# EAGLE schematic Syn-ShieldCarger-v07-tmp (EAGLE 5.10)
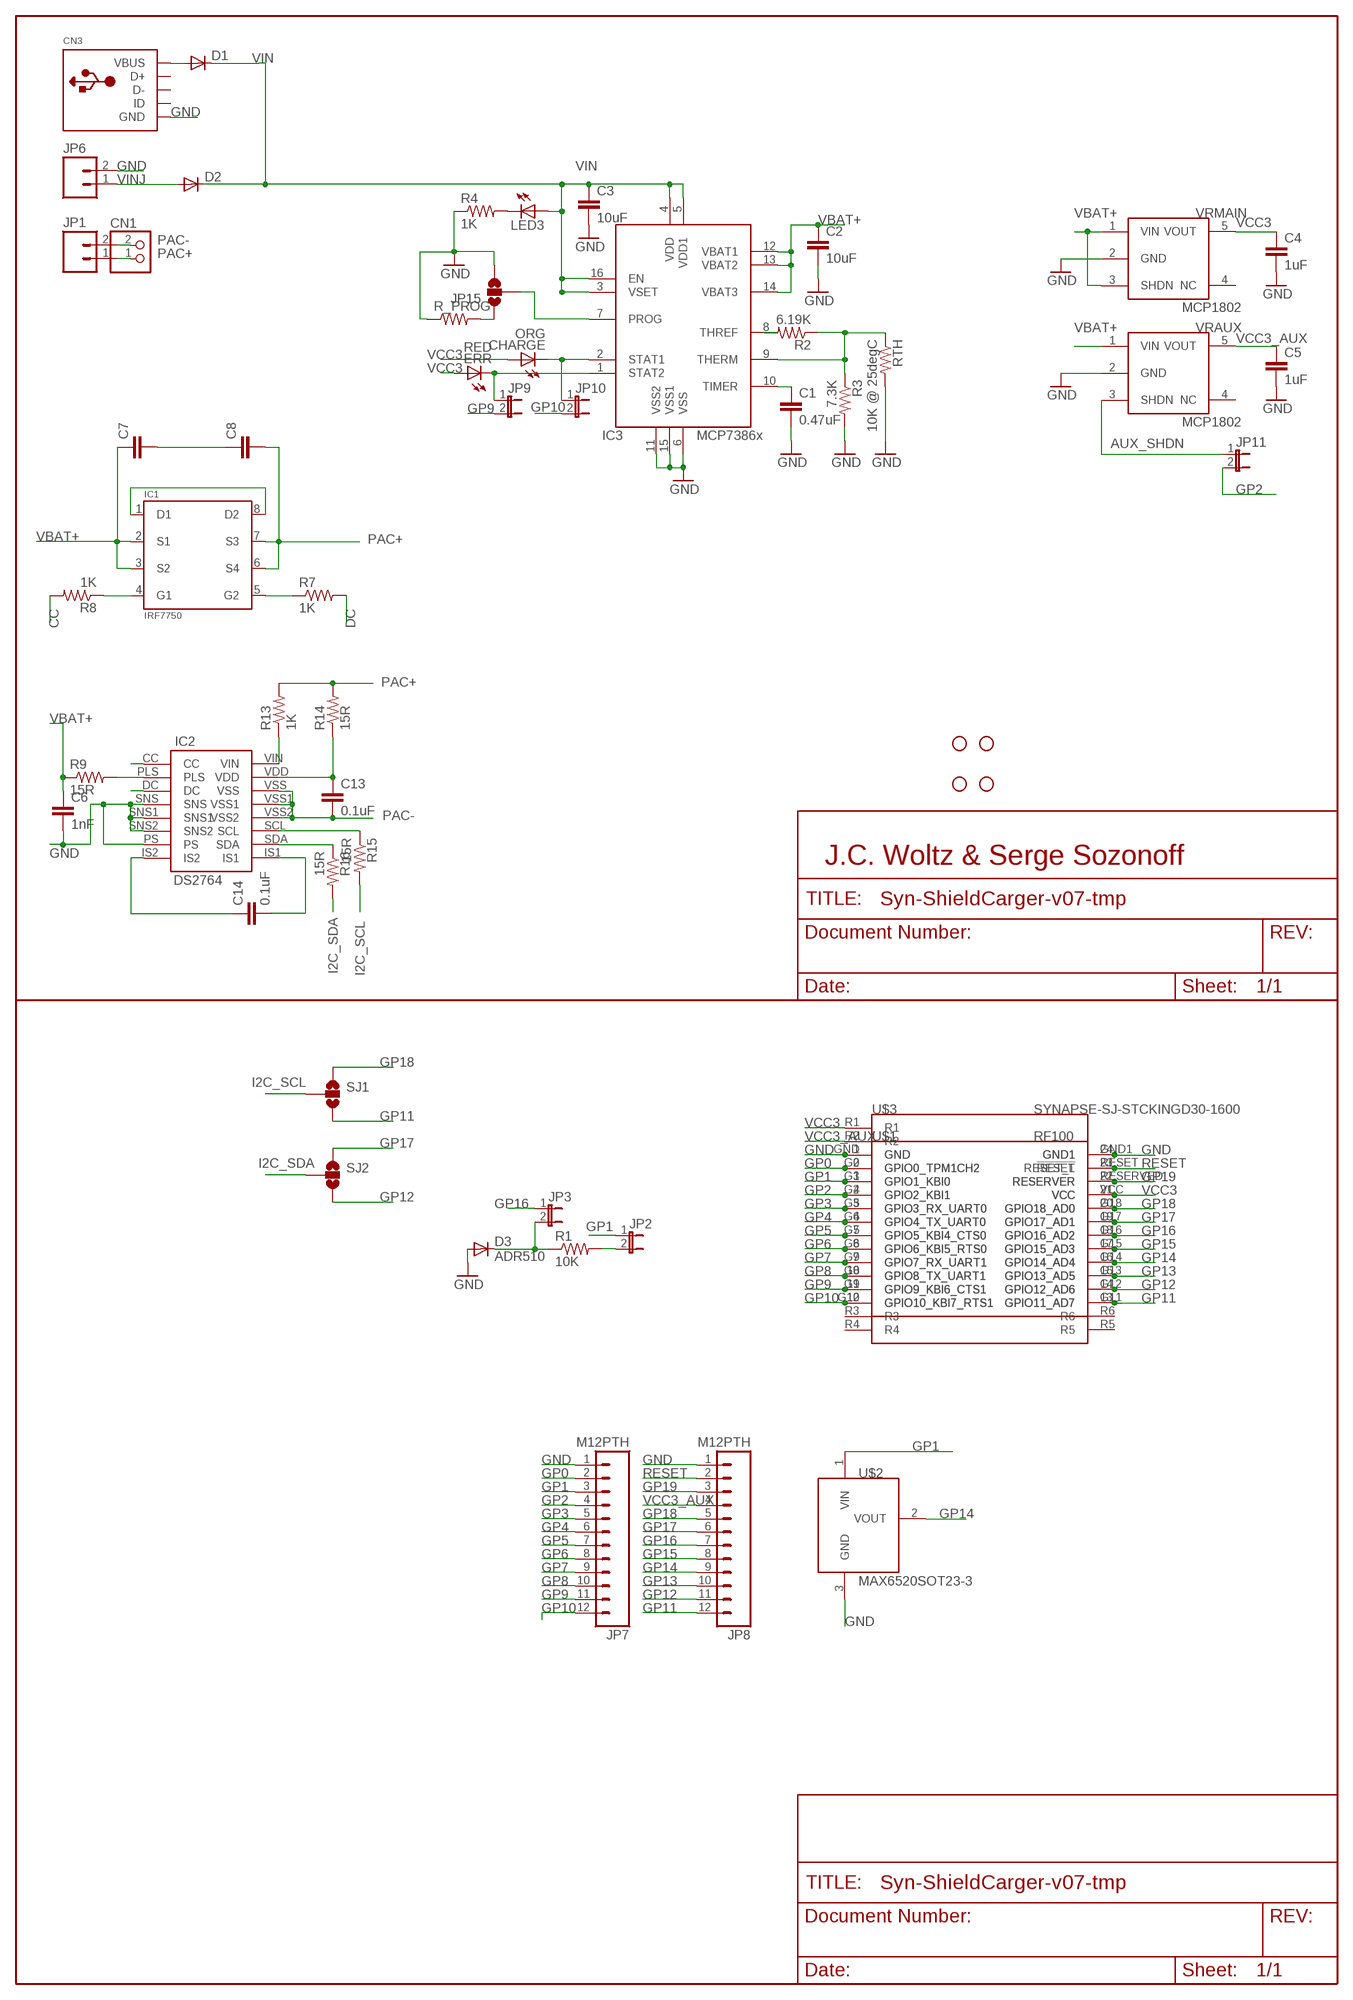
[diagram p0: schematic, sheet 1]

## Parts
C1  0.47uF  CAP0603-CAP  [0603-CAP]
C2  10uF  CAP1206  [1206]
C3  10uF  CAP1206  [1206]
C4  1uF  CAP0603-CAP  [0603-CAP]
C5  1uF  CAP0603-CAP  [0603-CAP]
C6  1nF  CAP0603-CAP  [0603-CAP]
C7  CAP0603-CAP  [0603-CAP]
C8  CAP0603-CAP  [0603-CAP]
C13  0.1uF  CAP0603-CAP  [0603-CAP]
C14  0.1uF  CAP0603-CAP  [0603-CAP]
CHARGE  ORG  LEDCHIPLED_0603  [CHIPLED_0603]
CN1  JST_2PIN-THM-RA  [JST-PH-2-THM-RA]
CN3  USBMINIB  [USB-MINIB]
D1  DIODESOD  [SOD-323]
D2  DIODESMA  [SMA-DIODE]
D3  ADR510  DIODESOT-23-3-ADR510  [SOT23-3]
ERR  RED  LEDCHIPLED_0603  [CHIPLED_0603]
IC1  IRF7750  [TSSOP8-4.4MM]
IC2  DS2764  [DS2764]
IC3  MCP73861SO16  [SO16-150MIL]
JP1  M02PTH  [1X02]
JP2  JUMPER-2SMD-NC  [SJ_2S]
JP3  JUMPER-2SMD-NC  [SJ_2S]
JP4  STAND-OFF  [STAND-OFF]
JP5  STAND-OFF  [STAND-OFF]
JP6  M023.5MM  [SCREWTERMINAL-3.5MM-2]
JP7  M12PTH  [1X12]
JP8  M12PTH  [1X12]
JP9  JUMPER-2SMD-NC  [SJ_2S]
JP10  JUMPER-2SMD-NC  [SJ_2S]
JP11  JUMPER-2SMD-NC  [SJ_2S]
JP12  STAND-OFF  [STAND-OFF]
JP15  SOLDERJUMPER_2WAYT  [SJ_2]
JP17  STAND-OFF  [STAND-OFF]
LED3  LEDCHIPLED_0603  [CHIPLED_0603]
R1  10K  RESISTOR0603-RES  [0603-RES]
R2  6.19K  RESISTOR0603-RES  [0603-RES]
R3  7.3K  RESISTOR0603-RES  [0603-RES]
R4  1K  RESISTOR0603-RES  [0603-RES]
R7  1K  RESISTOR0603-RES  [0603-RES]
R8  1K  RESISTOR0603-RES  [0603-RES]
R9  15R  RESISTOR0603-RES  [0603-RES]
R13  1K  RESISTOR0603-RES  [0603-RES]
R14  15R  RESISTOR0603-RES  [0603-RES]
R15  15R  RESISTOR0603-RES  [0603-RES]
R16  15R  RESISTOR0603-RES  [0603-RES]
R_PROG  RESISTORAXIAL-0603  [AXIAL-0603]
RTH  10K @ 25degC  RESISTORAXIAL-0603  [AXIAL-0603]
SJ1  SOLDERJUMPER_2WAYS  [SJ_3]
SJ2  SOLDERJUMPER_2WAYS  [SJ_3]
U$1  SYNAPSEWIRELESS-RFENGINESTD  SYNAPSEWIRELESS-RFENGINESTDTHM  [SYNAPSERFENGINE-THM]
U$2  MAX6520SOT23-3  [SOT23-3]
U$3  SYNAPSE-SJ-STCKINGD30-1600  [SYNSJ-STACK]
VRAUX  MCP1802  [SOT23-5]
VRMAIN  MCP1802  [SOT23-5]

## Nets
AUX_SHDN: JP11.1 VRAUX.3(SHDN)
CC: IC2.CC R8.2
DC: IC2.DC R7.2
GND: C1.2 C2.2 C3.2 C4.2 C5.2 C6.2 CN3.GND D3.2(A) IC2.PS IC2.SNS IC2.SNS1 IC2.SNS2 IC3.6(VSS) IC3.11(VSS2) IC3.15(VSS1) JP6.2 JP7.1 JP8.1 JP15.3 R3.2 R4.1 R_PROG.P$1 RTH.P$2 U$1.1(GND) U$1.24(GND1) U$2.3(GND) U$3.GND U$3.GND1 VRAUX.2(GND) VRMAIN.2(GND)
GP0: JP7.2 U$1.2(GPIO0_TPM1CH2) U$3.G0(GPIO0_TPM1CH2)
GP1: JP2.1 JP7.3 U$1.3(GPIO1_KBI0) U$2.1(VIN) U$3.G1(GPIO1_KBI0)
GP2: JP7.4 JP11.2 U$1.4(GPIO2_KBI1) U$3.G2(GPIO2_KBI1)
GP3: JP7.5 U$1.5(GPIO3_RX_UART0) U$3.G3(GPIO3_RX_UART0)
GP4: JP7.6 U$1.6(GPIO4_TX_UART0) U$3.G4(GPIO4_TX_UART0)
GP5: JP7.7 U$1.7(GPIO5_KBI4_CTS0) U$3.G5(GPIO5_KBI4_CTS0)
GP6: JP7.8 U$1.8(GPIO6_KBI5_RTS0) U$3.G6(GPIO6_KBI5_RTS0)
GP7: JP7.9 U$1.9(GPIO7_RX_UART1) U$3.G7(GPIO7_RX_UART1)
GP8: JP7.10 U$1.10(GPIO8_TX_UART1) U$3.G8(GPIO8_TX_UART1)
GP9: JP7.11 JP9.2 U$1.11(GPIO9_KBI6_CTS1) U$3.G9(GPIO9_KBI6_CTS1)
GP10: JP7.12 JP10.2 U$1.12(GPIO10_KBI7_RTS1) U$3.G10(GPIO10_KBI7_RTS1)
GP11: JP8.12 SJ1.3 U$1.13(GPIO11_AD7) U$3.G11(GPIO11_AD7)
GP12: JP8.11 SJ2.3 U$1.14(GPIO12_AD6) U$3.G12(GPIO12_AD6)
GP13: JP8.10 U$1.15(GPIO13_AD5) U$3.G13(GPIO13_AD5)
GP14: JP8.9 U$1.16(GPIO14_AD4) U$2.2(VOUT) U$3.G14(GPIO14_AD4)
GP15: JP8.8 U$1.17(GPIO15_AD3) U$3.G15(GPIO15_AD3)
GP16: JP3.1 JP8.7 U$1.18(GPIO16_AD2) U$3.G16(GPIO16_AD2)
GP17: JP8.6 SJ2.1 U$1.19(GPIO17_AD1) U$3.G17(GPIO17_AD1)
GP18: JP8.5 SJ1.1 U$1.20(GPIO18_AD0) U$3.G18(GPIO18_AD0)
GP19: JP8.3 U$1.22(RESERVER) U$3.RESERVED(RESERVER)
I2C_SCL: R15.2 SJ1.2
I2C_SDA: R16.2 SJ2.2
N$1: IC1.1(D1) IC1.8(D2)
N$2: LED3.C R4.2
N$3: D3.1(C) JP3.2 R1.1
N$4: JP2.2 R1.2
N$5: IC1.4(G1) R8.1
N$6: IC3.7(PROG) JP15.2
N$7: IC3.8(THREF) R2.2
N$8: IC3.9(THERM) R2.1 R3.1 RTH.P$1
N$9: C1.1 IC3.10(TIMER)
N$10: JP15.1 R_PROG.P$2
N$14: IC1.5(G2) R7.1
N$15: IC2.VIN R13.1
N$16: C14.2 IC2.IS1
N$17: IC2.SCL R15.1
N$18: C13.1 IC2.VDD R14.1
N$19: C7.2 C8.1
N$21: CN3.VBUS D1.2(A)
N$24: C14.1 IC2.IS2
N$25: IC2.SDA R16.1
PAC+: C8.2 CN1.1 IC1.6(S4) IC1.7(S3) JP1.1 R13.2 R14.2
PAC-: C13.2 CN1.2 IC2.VSS IC2.VSS1 IC2.VSS2 JP1.2
PLS: IC2.PLS R9.2
RESET: JP8.2 U$1.23(RESET_L) U$3.RESET(!RESET)
STAT1: CHARGE.C IC3.2(STAT1) JP10.1
STAT2: ERR.C IC3.1(STAT2) JP9.1
VBAT+: C2.1 C6.1 C7.1 IC1.2(S1) IC1.3(S2) IC3.12(VBAT1) IC3.13(VBAT2) IC3.14(VBAT3) R9.1 VRAUX.1(VIN) VRMAIN.1(VIN) VRMAIN.3(SHDN)
VCC3: C4.1 CHARGE.A ERR.A U$1.21(VCC) U$3.R1 U$3.VCC VRMAIN.5(VOUT)
VCC3_AUX: C5.1 JP8.4 U$3.R2 VRAUX.5(VOUT)
VIN: C3.1 D1.1(C) D2.C IC3.3(VSET) IC3.4(VDD) IC3.5(VDD1) IC3.16(EN) LED3.A
VINJ: D2.A JP6.1
Unconnected: CN3.D+ CN3.D- CN3.ID U$3.R3 U$3.R4 U$3.R5 U$3.R6 VRAUX.4(NC) VRMAIN.4(NC)

## Notes on the sheet
- J.C. Woltz & Serge Sozonoff

## Library data of the parts
C1-C8 C13 C14 = SparkFun:CAP: Capacitor Standard 0603 ceramic capacitor, and 0.1" leaded capacitor.
CHARGE ERR LED3 = adafruit:LED: LED OSRAM: - CHIPLED LG R971, LG N971, LY N971, LG Q971, LY Q971, LO R971, LY R971 LH N974, LH R974 LS Q976, LO Q976, LY Q976 LO Q996 - Hyper CHIPLED LW Q18S LB Q993, LB Q99A, LB R99A - SideLED LS A670, LO A670, LY A670, LG A670, LP A670 LB A673, LV A673, LT A673, LW A673 LH A674 LY A675 LS A676, LA A676, LO A676, LY A676, LW A676 LS A679, LY A679, LG A679 - Hyper Micro SIDELED® LS Y876, LA Y876, LO Y876, LY Y876 LT Y87S - SmartLED LW L88C, LW L88S LB L89C, LB L89S, LG L890 LS L89K, LO L89K, LY L89K LS L896, LA L896, LO L896, LY L896 - TOPLED LS T670, LO T670, LY T670, LG T670, LP T670 LSG T670, LSP T670, LSY T670, LOP T670, LYG T670 LG T671, LOG T671, LSG T671 LB T673, LV T673, LT T673, LW T673 LH T674 LS T676, LA T676, LO T676, LY T676, LB T676, LH T676, LSB T676, LW T676 LB T67C, LV T67C, LT T67C, LS T67K, LO T67K, LY T67K, LW E67C LS E67B, LA E67B, LO E67B, LY E67B, LB E67C, LV E67C, LT E67C LW T67C LS T679, LY T679, LG T679 LS T770, LO T770, LY T770, LG T770, LP T770 LB T773, LV T773, LT T773, LW T773 LH T774 LS E675, LA E675, LY E675, LS T675 LS T776, LA T776, LO T776, LY T776, LB T776 LHGB T686 LT T68C, LB T68C - Hyper Mini TOPLED® LB M676 - Mini TOPLED Santana® LG M470 LS M47K, LO M47K, LY M47K Source: http://www.osram.convergy.de/
CN1 = adafruit:JST_2PIN: JST 2-Pin Connectors of various flavors SMT-RA (S2B-PH-SM4) 4UConnector #17311 SMT (B2B-PH-SM4) THM-RA (S2B-PH) THM (B2B-PH)
CN3 = adafruit:USB: USB Connectors USBMINIB - Surface Mount Female Mini-B USB Connector 4UConnector: 06564 By microbuilder.eu Thru-hole RA Female Mini-B USB Connector 4UConnector: 18732 By ladyada.net
D1 D2 = SparkFun:DIODE: Diode These are standard reverse protection diodes and small signal diodes. SMA package can handle up to about 1A. SOD-323 can handle about 200mA. What the SOD-323 package when ordering, there are some mfgs out there that are 5-pin packages.
D3 = 0_jc-modified:DIODE: Diode These are standard reverse protection diodes and small signal diodes. SMA package can handle up to about 1A. SOD-323 can handle about 200mA. What the SOD-323 package when ordering, there are some mfgs out there that are 5-pin packages.
IC1 = ssozonoff:IRF7750: HEXFET® power MOSFETs from International Rectifier utilize advanced processing techniques to achieve extremely low on-resistance per silicon area. This benefit, combined with the ruggedized device design, that International Rectifier is well known for, provides the designer with an extremely efficient and reliable device for battery and load management.
IC2 = ssozonoff:DS2764
IC3 = 0_jc-custom:MCP73861
JP1 JP6 = SparkFun:M02: Header 2 Standard 2-pin 0.1" header. Use with straight break away headers (SKU : PRT-00116), right angle break away headers (PRT-00553), swiss pins (PRT-00743), machine pins (PRT-00117), and female headers (PRT-00115). Molex polarized connector foot print use with SKU : PRT-08233 with associated crimp pins and housings.
JP2 JP3 JP9-JP11 = SparkFun:JUMPER-2: Jumper Basic 0.1" spaced jumper. Use with breakaway headers.
JP4 JP5 JP12 JP17 = SparkFun:STAND-OFF: Stand Off This is the mechanical footprint for a #4 phillips button head screw. Use the keepout ring to avoid running the screw head into surrounding components. SKU : PRT-00447
JP7 JP8 = SparkFun:M12: Header 12 Standard 12-pin 0.1" header. Use with straight break away headers (SKU : PRT-00116), right angle break away headers (PRT-00553), swiss pins (PRT-00743), machine pins (PRT-00117), and female headers (PRT-00115).
JP15 SJ1 SJ2 = SparkFun:SOLDERJUMPER_2WAY: Solder Jumper 2 way solder jumper
R1 R4 R7-R9 R13-R16 = SparkFun:RESISTOR: Resistor Basic schematic elements and footprints for 0603, 1206, and PTH 1/10th watt (small) resistors.
R2 R3 R_PROG RTH = 0_jc-custom:RESISTOR
U$1 = 0_jc-custom:SYNAPSEWIRELESS-RFENGINE
U$2 = 0_jc-custom:MAX6520
U$3 = 0_jc-custom:SYNAPSE-SJ-STCKING: Standard layout for expansion modules using Synapse Wireless boards
VRAUX VRMAIN = 0_jc-modified:MCP1802